# Altium project waku-ctl-board.PrjPcb (part 5 of 5)
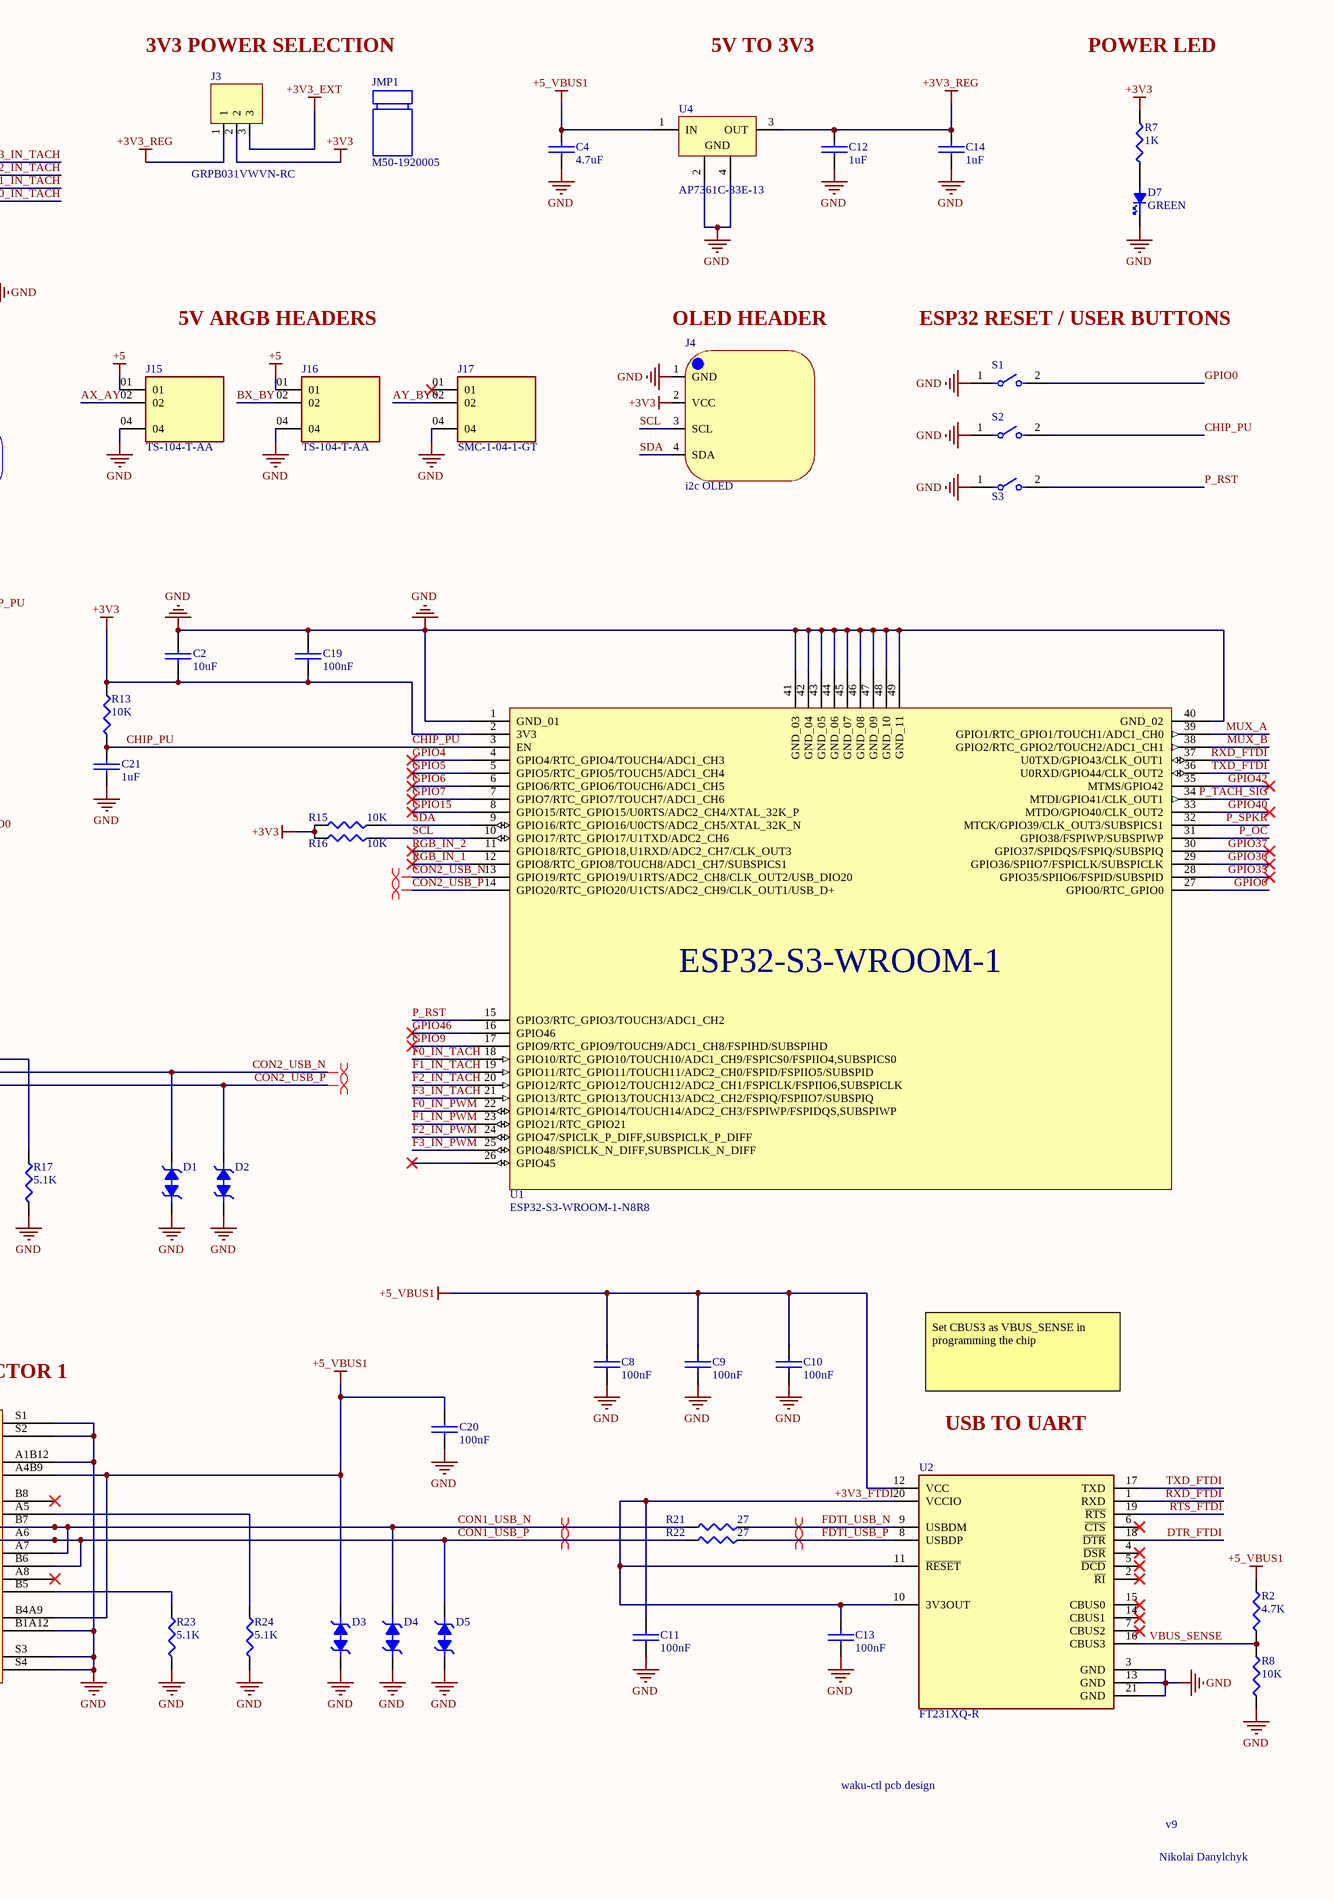
[diagram p5: waku-ctl.SchDoc, right]

## Sheet waku-ctl.SchDoc (continued)

### Library data of the parts (continued)
U8 = SN74HC14PWR: IC INVERTER 6CH 1-INP 14TSSOP; Manufacturer: Texas Instruments; Manufacturer Lifecycle Status: ACTIVE; High Level Output Current: -5.2mA; Logic Function: Buffer, Inverter, Schmitt Trigger; Low Level Output Current: 5.2mA; Max Junction Temperature (Tj): 150°C; Max Supply Voltage: 6V; Min Supply Voltage: 2V; Nominal Supply Current: 2µA; Number of Bits: 6; Number of Inputs: 1; Operating Supply Voltage: 5V; Output Current: 25mA; Propagation Delay: 11ns; Turn-On Delay Time: 31ns; Supplier: DigiKey; Supplier Part Number: 296-8234-1-ND; Manufacturer Part Number: SN74HC14PWR; RoHS: Compliant; Category: Logic Gates; Stock: 34107; Pricing: 1=0.25, 10=0.174, 25=0.25, 100=0.1324, 250=0.12204, 500=0.11582, 1000=0.11069 (EUR); Ambient Temperature Range High: 85°C; Case/Package: TSSOP; Contact Plating: Gold; Height: 0m; Lead Free: Lead Free; Length: 5mm; Lifecycle Status: Production; Max Operating Temperature: 85°C; Min Operating Temperature: -40°C; Mounting Technology: Surface Mount; Number of Channels: 6; Number of Circuits: 6; Number of Elements: 6; Number of Gates: 6; Number of Outputs: 1; Pins: 14; Quiescent Current: 2µA; Radiation Hardening: No; REACH SVHC: No; Schedule B: 8542390000, 8542390000|8542390000|8542390000|8542390000|8542390000; Thickness: 1mm; Weight: 57.209338mg; Width: 4.4mm; ComponentLink1URL: https://sigma.octopart.com:443/182471031/technical_drawing/Texas-Instruments-SN74HC14PWR.pdf?src-supplier=Texas+Instruments; ComponentLink1Description: https://sigma.octopart.com:443/182471031/technical_drawing/Texas-Instruments-SN74HC14PWR.pdf?src-supplier=Texas+Instruments; ComponentLink2URL: https://octopart.com:443/opatz8j6/c1?t=mgRqS-hfAv7mW99aHGtXe0uUQtkE4j_ResFexbnUcfozyNiycuVPUD79LJdKfGOCnCdkgkYZTUKD9_-dfm0Fcd2jq3Eu8k-uXuUYFXBpJ7Fb_Dfnew8Ij2yrF2NZXflAE1Q8RIB_BRTD8wfNgg4gHkuUohgl8J8utb9PDFkQshknjIQL1jQPyJjA17LwX5cfq7MDZsGjhLLtgG-DO7cbyCef4COWysZxDjztciZmLaZLrABMH2FQMHC6HNyCzTqN1Wgw2LiaTUC6_zrgfsxfl-iQ2kU3qIlY6q5pj8XVvm1obkSu-F1OyAmKNyh8mkA6ypTuZJh0ZT_h2OZ458n8XOPegfQ8-jxvAxswD2V3FJ6yclYDOJwov7Kxj2cqY3xhFk-1Ew&src-supplier=Texas+Instruments; ComponentLink2Description: https://octopart.com:443/opatz8j6/c1?t=mgRqS-hfAv7mW99aHGtXe0uUQtkE4j_ResFexbnUcfozyNiycuVPUD79LJdKfGOCnCdkgkYZTUKD9_-dfm0Fcd2jq3Eu8k-uXuUYFXBpJ7Fb_Dfnew8Ij2yrF2NZXflAE1Q8RIB_BRTD8wfNgg4gHkuUohgl8J8utb9PDFkQshknjIQL1jQPyJjA17LwX5cfq7MDZsGjhLLtgG-DO7cbyCef4COWysZxDjztciZmLaZLrABMH2FQMHC6HNyCzTqN1Wgw2LiaTUC6_zrgfsxfl-iQ2kU3qIlY6q5pj8XVvm1obkSu-F1OyAmKNyh8mkA6ypTuZJh0ZT_h2OZ458n8XOPegfQ8-jxvAxswD2V3FJ6yclYDOJwov7Kxj2cqY3xhFk-1Ew&src-supplier=Texas+Instruments; ComponentLink3URL: https://datasheet.octopart.com:443/SN74HC14PWR-Texas-Instruments-datasheet-22122188.pdf?src-supplier=Texas+Instruments; ComponentLink3Description: https://datasheet.octopart.com:443/SN74HC14PWR-Texas-Instruments-datasheet-22122188.pdf?src-supplier=Texas+Instruments; ComponentLink4URL: https://datasheet.octopart.com:443/SN74HC14PWR-Texas-Instruments-datasheet-10743327.pdf?src-supplier=Texas+Instruments; ComponentLink4Description: https://datasheet.octopart.com:443/SN74HC14PWR-Texas-Instruments-datasheet-10743327.pdf?src-supplier=Texas+Instruments; ComponentLink5URL: https://datasheet.octopart.com:443/SN74HC14PWR-Texas-Instruments-datasheet-10254369.pdf?src-supplier=Texas+Instruments; ComponentLink5Description: https://datasheet.octopart.com:443/SN74HC14PWR-Texas-Instruments-datasheet-10254369.pdf?src-supplier=Texas+Instruments; ComponentLink6URL: https://sigma.octopart.com:443/49249819/technical_drawing/Texas-Instruments-SN74HC14PWR.pdf?src-supplier=Texas+Instruments; ComponentLink6Description: https://sigma.octopart.com:443/49249819/technical_drawing/Texas-Instruments-SN74HC14PWR.pdf?src-supplier=Texas+Instruments; ComponentLink7URL: https://datasheet.octopart.com:443/SN74HC14PWR-Texas-Instruments-datasheet-151874.pdf?src-supplier=Texas+Instruments; ComponentLink7Description: https://datasheet.octopart.com:443/SN74HC14PWR-Texas-Instruments-datasheet-151874.pdf?src-supplier=Texas+Instruments; ComponentLink8URL: https://datasheet.octopart.com:443/SN74HC14PWR-Texas-Instruments-datasheet-37129453.pdf?src-supplier=Farnell; ComponentLink8Description: https://datasheet.octopart.com:443/SN74HC14PWR-Texas-Instruments-datasheet-37129453.pdf?src-supplier=Farnell; ComponentLink9URL: https://datasheet.octopart.com:443/SN74HC14PWR-Texas-Instruments-datasheet-12357349.pdf?src-supplier=Farnell; ComponentLink9Description: https://datasheet.octopart.com:443/SN74HC14PWR-Texas-Instruments-datasheet-12357349.pdf?src-supplier=Farnell; ComponentLink10URL: https://datasheet.octopart.com:443/SN74HC14PWR-Texas-Instruments-datasheet-11517478.pdf?src-supplier=Farnell; ComponentLink10Description: https://datasheet.octopart.com:443/SN74HC14PWR-Texas-Instruments-datasheet-11517478.pdf?src-supplier=Farnell; ComponentLink11URL: https://datasheet.octopart.com:443/SN74HC14PWR-Texas-Instruments-datasheet-62115966.pdf?src-supplier=Farnell; ComponentLink11Description: https://datasheet.octopart.com:443/SN74HC14PWR-Texas-Instruments-datasheet-62115966.pdf?src-supplier=Farnell; ComponentLink12URL: https://datasheet.octopart.com:443/SN74HC14PWR-Texas-Instruments-datasheet-147851288.pdf?src-supplier=Upverter; ComponentLink12Description: https://datasheet.octopart.com:443/SN74HC14PWR-Texas-Instruments-datasheet-147851288.pdf?src-supplier=Upverter; ComponentLink13URL: https://datasheet.octopart.com:443/SN74HC14PWR-Texas-Instruments-datasheet-62313149.pdf?src-supplier=Newark; ComponentLink13Description: https://datasheet.octopart.com:443/SN74HC14PWR-Texas-Instruments-datasheet-62313149.pdf?src-supplier=Newark; ComponentLink14URL: https://datasheet.octopart.com:443/SN74HC14PWR-Texas-Instruments-datasheet-32036646.pdf?src-supplier=element14+APAC; ComponentLink14Description: https://datasheet.octopart.com:443/SN74HC14PWR-Texas-Instruments-datasheet-32036646.pdf?src-supplier=element14+APAC; ComponentLink15URL: https://datasheet.octopart.com:443/SN74HC14PWR-Texas-Instruments-datasheet-165804426.pdf?src-supplier=LCSC; ComponentLink15Description: https://datasheet.octopart.com:443/SN74HC14PWR-Texas-Instruments-datasheet-165804426.pdf?src-supplier=LCSC; ComponentLink16URL: https://datasheet.octopart.com:443/SN74HC14PWR-Texas-Instruments-datasheet-159116051.pdf?src-supplier=LCSC; ComponentLink16Description: https://datasheet.octopart.com:443/SN74HC14PWR-Texas-Instruments-datasheet-159116051.pdf?src-supplier=LCSC; ComponentLink17URL: https://datasheet.octopart.com:443/SN74HC14PWR-Texas-Instruments-datasheet-166100818.pdf?src-supplier=Augswan; ComponentLink17Description: https://datasheet.octopart.com:443/SN74HC14PWR-Texas-Instruments-datasheet-166100818.pdf?src-supplier=Augswan; ComponentLink18URL: https://datasheet.octopart.com:443/SN74HC14PWR-Texas-Instruments-datasheet-137316104.pdf?src-supplier=Future+Electronics; ComponentLink18Description: https://datasheet.octopart.com:443/SN74HC14PWR-Texas-Instruments-datasheet-137316104.pdf?src-supplier=Future+Electronics; ComponentLink19URL: https://datasheet.octopart.com:443/SN74HC14PWR-Texas-Instruments-datasheet-14147618.pdf?src-supplier=iiiC; ComponentLink19Description: https://datasheet.octopart.com:443/SN74HC14PWR-Texas-Instruments-datasheet-14147618.pdf?src-supplier=iiiC; ComponentLink20URL: https://datasheet.octopart.com:443/SN74HC14PWR-Texas-Instruments-datasheet-11551913.pdf?src-supplier=Arrow+Electronics; ComponentLink20Description: https://datasheet.octopart.com:443/SN74HC14PWR-Texas-Instruments-datasheet-11551913.pdf?src-supplier=Arrow+Electronics; ComponentLink21URL: https://datasheet.octopart.com:443/SN74HC14PWR-Texas-Instruments-datasheet-41751.pdf?src-supplier=DigiKey; ComponentLink21Description: https://datasheet.octopart.com:443/SN74HC14PWR-Texas-Instruments-datasheet-41751.pdf?src-supplier=DigiKey; ComponentLink22URL: https://datasheet.octopart.com:443/SN74HC14PWR-Texas-Instruments-datasheet-7558321.pdf?src-supplier=Jameco; ComponentLink22Description: https://datasheet.octopart.com:443/SN74HC14PWR-Texas-Instruments-datasheet-7558321.pdf?src-supplier=Jameco; ComponentLink23URL: https://datasheet.octopart.com:443/SN74HC14PWR-Texas-Instruments-datasheet-114860.pdf?src-supplier=Sierra+IC; ComponentLink23Description: https://datasheet.octopart.com:443/SN74HC14PWR-Texas-Instruments-datasheet-114860.pdf?src-supplier=Sierra+IC; ComponentLink24URL: http://sigma.octopart.com:80/conflict_mineral_statement/Texas-Instruments-company-63.pdf?src-supplier=Compliance+Statements; ComponentLink24Description: http://sigma.octopart.com:80/conflict_mineral_statement/Texas-Instruments-company-63.pdf?src-supplier=Compliance+Statements; ComponentLink25URL: http://sigma.octopart.com:80/reach_statement/Texas-Instruments-company-64.pdf?src-supplier=Compliance+Statements; ComponentLink25Description: http://sigma.octopart.com:80/reach_statement/Texas-Instruments-company-64.pdf?src-supplier=Compliance+Statements; LCSC Part Number: C6821

## Assembly variants
waku-ctl-prototype: all parts fitted